# EAGLE design receptor_same (EAGLE 9.3.2)

## Sheet 1 of 2
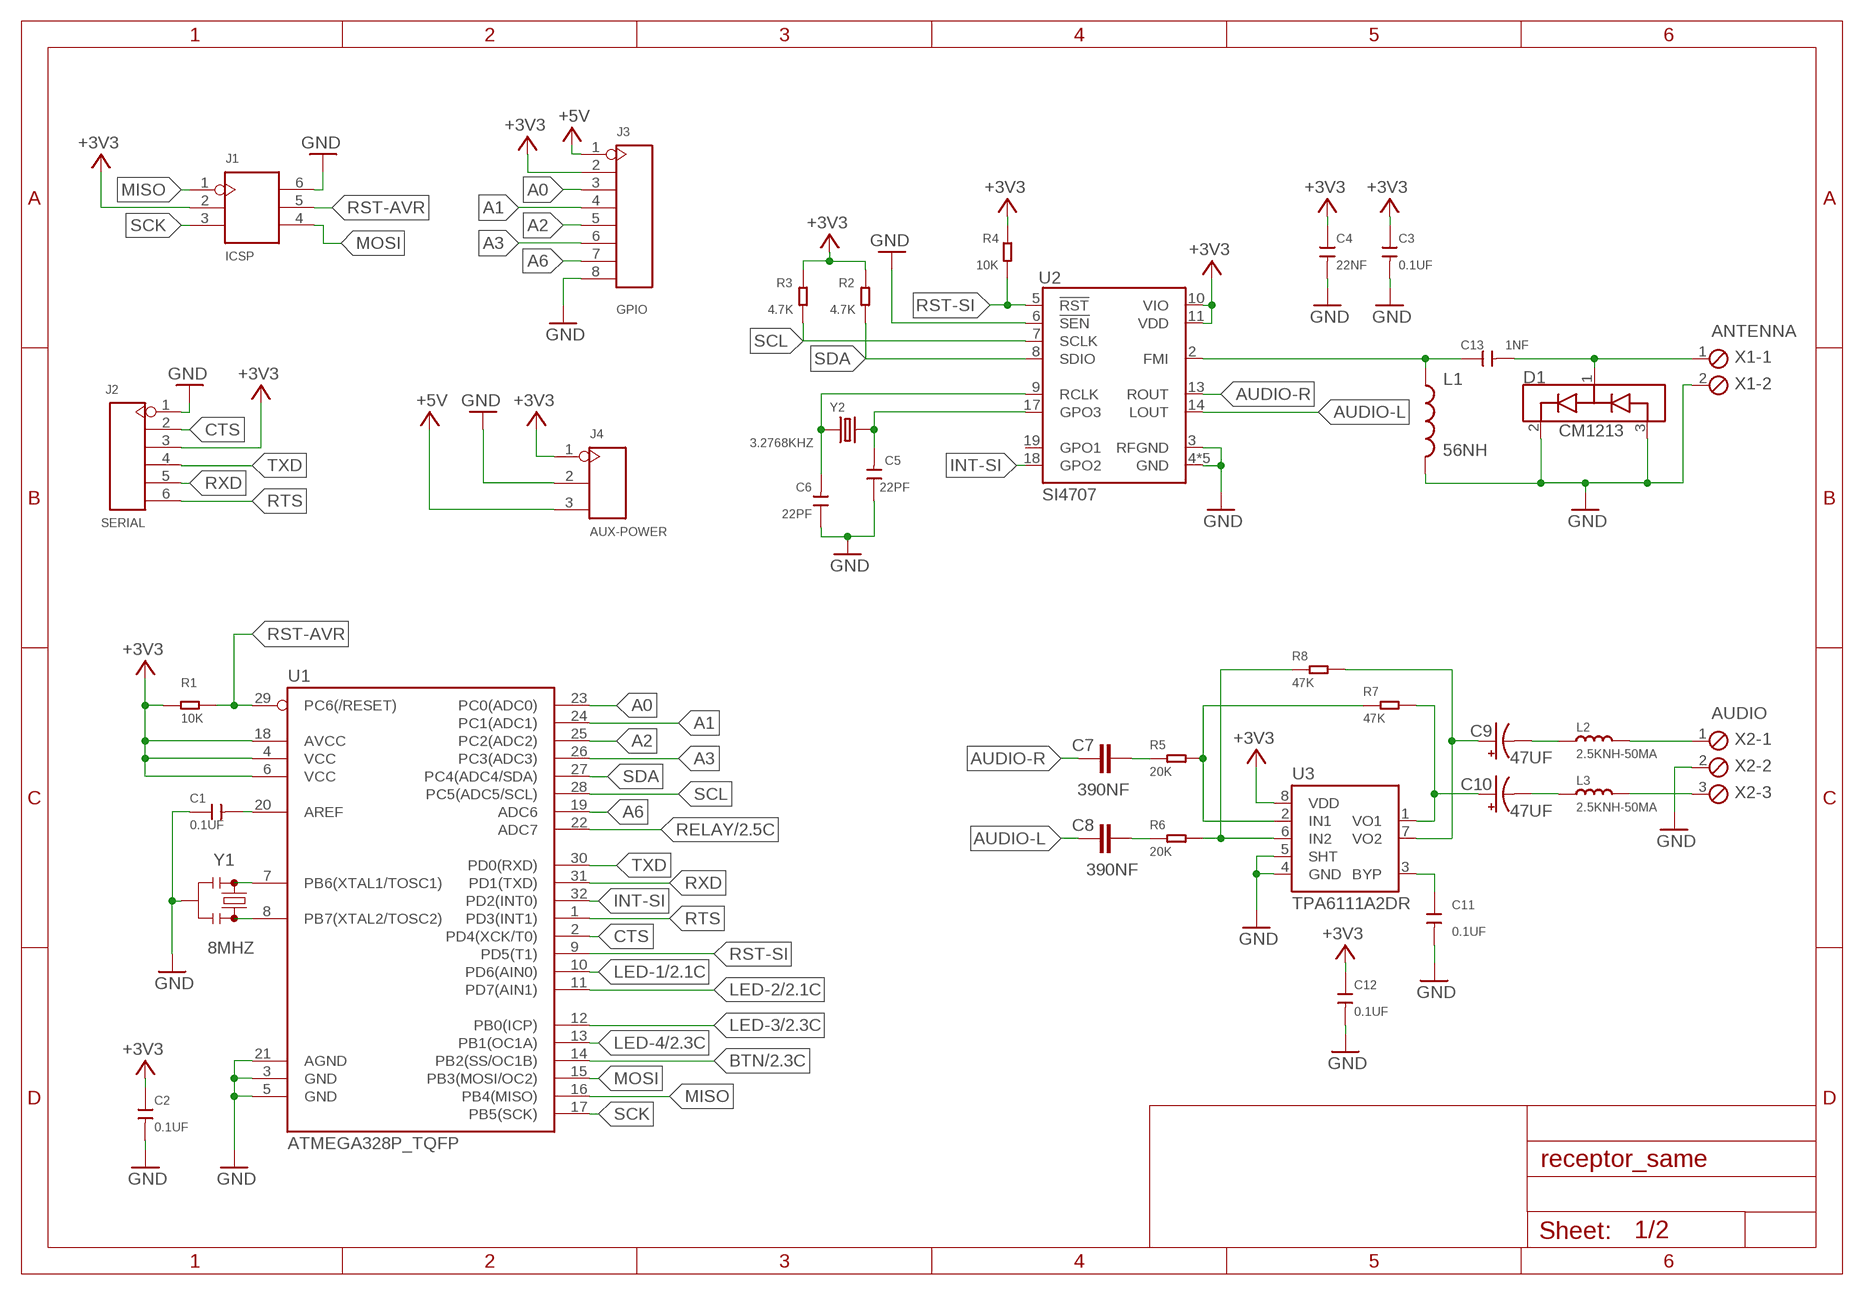
[diagram p0: schematic, sheet 1]

### Parts
C1  0.1UF  CERAMIC-100NF-50V-10%-X7R(0603)  [C0603]
C2  0.1UF  CERAMIC-100NF-50V-10%-X7R(0603)  [C0603]
C3  0.1UF  CERAMIC-100NF-50V-10%-X7R(0603)  [C0603]
C4  22NF  CERAMIC-22NF-50V-10%-X7R(0603)  [C0603]
C5  22PF  CERAMIC-22PF-50V-5%-NPO(0603)  [C0603]
C6  22PF  CERAMIC-22PF-50V-5%-NPO(0603)  [C0603]
C7  390NF  390NF-0603-10V-10%  [0603]
C8  390NF  390NF-0603-10V-10%  [0603]
C9  47UF  47UF-POLAR-EIA3528-10V-10%  [EIA3528]
C10  47UF  47UF-POLAR-EIA3528-10V-10%  [EIA3528]
C11  0.1UF  CERAMIC-100NF-50V-10%-X7R(0603)  [C0603]
C12  0.1UF  CERAMIC-100NF-50V-10%-X7R(0603)  [C0603]
C13  1NF  CERAMIC-1NF-50V-5%-C0G(0603)  [C0603]
D1  CM1213  SPARKFUN-DISCRETESEMI_CM1213  [SPARKFUN-DISCRETESEMI_SOT23-3]
J1  ICSP  DIP-BLACK-MALE-HEADER(2X3P-2.54）-2.54  [H2X3-2.54]
J2  SERIAL  DIP-BLACK-MALE-HEADER(6P-2.54)  [H6-2.54]
J3  GPIO  DIP-BLACK-MALE-HEADER-VERT(8P-2.54)  [H8-2.54]
J4  AUX-POWER  DIP-BLACK-MALE-HEADER-VERT(3P-2.54)  [H3-2.54]
L1  56NH  SPARKFUN-PASSIVES_INDUCTOR0603  [SPARKFUN-PASSIVES_0603]
L2  2.5KNH-50MA  SMD-INDUCTOR-4.7NH-0.3NH-300MA(0402)  [L0402]
L3  2.5KNH-50MA  SMD-INDUCTOR-4.7NH-0.3NH-300MA(0402)  [L0402]
R1  10K  SMD-RES-10K-5%-1/10W(0603)  [R0603]
R2  4.7K  SMD-RES-4.7K-5%-1/10W(0603)  [R0603]
R3  4.7K  SMD-RES-4.7K-5%-1/10W(0603)  [R0603]
R4  10K  SMD-RES-10K-5%-1/10W(0603)  [R0603]
R5  20K  SMD-RES-20K-1%-1/10W(0603)  [R0603]
R6  20K  SMD-RES-20K-1%-1/10W(0603)  [R0603]
R7  47K  SMD-RES-47K-5%-1/10W(0603)  [R0603]
R8  47K  SMD-RES-47K-5%-1/10W(0603)  [R0603]
U1  ATMEGA328P_TQFP  [TQFP32-08]
U2  SI4707  SPARKFUN-RF_SI4707  [SPARKFUN-RF_SI470X]
U3  TPA6111A2DR  TPA6111SMD-T  [SO08]
X1  ANTENNA  MPT2  [2POL254]
X2  AUDIO  MPT3  [3POL254]
Y1  8MHZ  RESONATOR-8MHZSMD_3.2X1.3  [RESONATOR-SMD-3.2X1.3]
Y2  3.2768KHZ  SMD-CRYSTAL-32.768KHZ-12.5PF-20PPM-90K(2P-L2.0X1.2MM)  [X2-SMD-L2.0X1.2X0.55MM]

### Nets
+3V3: C2.1 C3.1 C4.1 C12.1 J1.2 J2.3 J3.2 J4.1 R1.2 R2.1 R3.1 R4.1 U1.4(VCC) U1.6(VCC) U1.18(AVCC) U2.10(VIO) U2.11(VDD) U3.8(VDD) ; also sheet 2
+5V: J3.1 J4.3 ; also sheet 2
A0: J3.3 U1.23(PC0(ADC0))
A1: J3.4 U1.24(PC1(ADC1))
A2: J3.5 U1.25(PC2(ADC2))
A3: J3.6 U1.26(PC3(ADC3))
A6: J3.7 U1.19(ADC6)
AUDIO-L: C8.1 U2.14(LOUT)
AUDIO-R: C7.1 U2.13(ROUT)
BTN: U1.14(PB2(SS/OC1B)) ; also sheet 2
CTS: J2.2 U1.2(PD4(XCK/T0))
GND: C1.1 C2.2 C3.2 C4.2 C5.1 C6.1 C11.2 C12.2 D1.2(VP) D1.3(VN) J1.6 J2.1 J3.8 J4.2 L1.2 U1.3(GND) U1.5(GND) U1.21(AGND) U2.3(RFGND) U2.4(GND) U2.6(!SEN) U2.12(GND) U2.15(GND) U2.16(GND) U2.21(GND) U3.4(GND) U3.5(SHT) X1.2 X2.2 Y1.2 ; also sheet 2
INT-SI: U1.32(PD2(INT0)) U2.18(GPO2)
L: L2.2 X2.1
LED-1: U1.10(PD6(AIN0)) ; also sheet 2
LED-2: U1.11(PD7(AIN1)) ; also sheet 2
LED-3: U1.12(PB0(ICP)) ; also sheet 2
LED-4: U1.13(PB1(OC1A)) ; also sheet 2
MISO: J1.1 U1.16(PB4(MISO))
MOSI: J1.4 U1.15(PB3(MOSI/OC2))
N$1: U1.7(PB6(XTAL1/TOSC1)) Y1.1
N$2: U1.8(PB7(XTAL2/TOSC2)) Y1.3
N$3: C1.2 U1.20(AREF)
N$4: C5.2 U2.17(GPO3) Y2.2
N$5: C6.2 U2.9(RCLK) Y2.1
N$6: C13.1 L1.1 U2.2(FMI)
N$7: C7.2 R5.1
N$8: C8.2 R6.1
N$9: C11.1 U3.3(BYP)
N$10: R5.2 R7.1 U3.2(IN1)
N$11: C10.A(+) R7.2 U3.1(VO1)
N$12: R6.2 R8.1 U3.6(IN2)
N$13: C9.A(+) R8.2 U3.7(VO2)
N$14: C9.C(-) L2.1
N$17: C10.C(-) L3.1
N$22: C13.2 D1.1(CH1) X1.1
R: L3.2 X2.3
RELAY: U1.22(ADC7) ; also sheet 2
RST-AVR: J1.5 R1.1 U1.29(PC6(/RESET))
RST-SI: R4.2 U1.9(PD5(T1)) U2.5(!RST)
RTS: J2.6 U1.1(PD3(INT1))
RXD: J2.5 U1.31(PD1(TXD))
SCK: J1.3 U1.17(PB5(SCK))
SCL: R3.2 U1.28(PC5(ADC5/SCL)) U2.7(SCLK)
SDA: R2.2 U1.27(PC4(ADC4/SDA)) U2.8(SDIO)
TXD: J2.4 U1.30(PD0(RXD))
Unconnected: U2.19(GPO1)

## Sheet 2 of 2
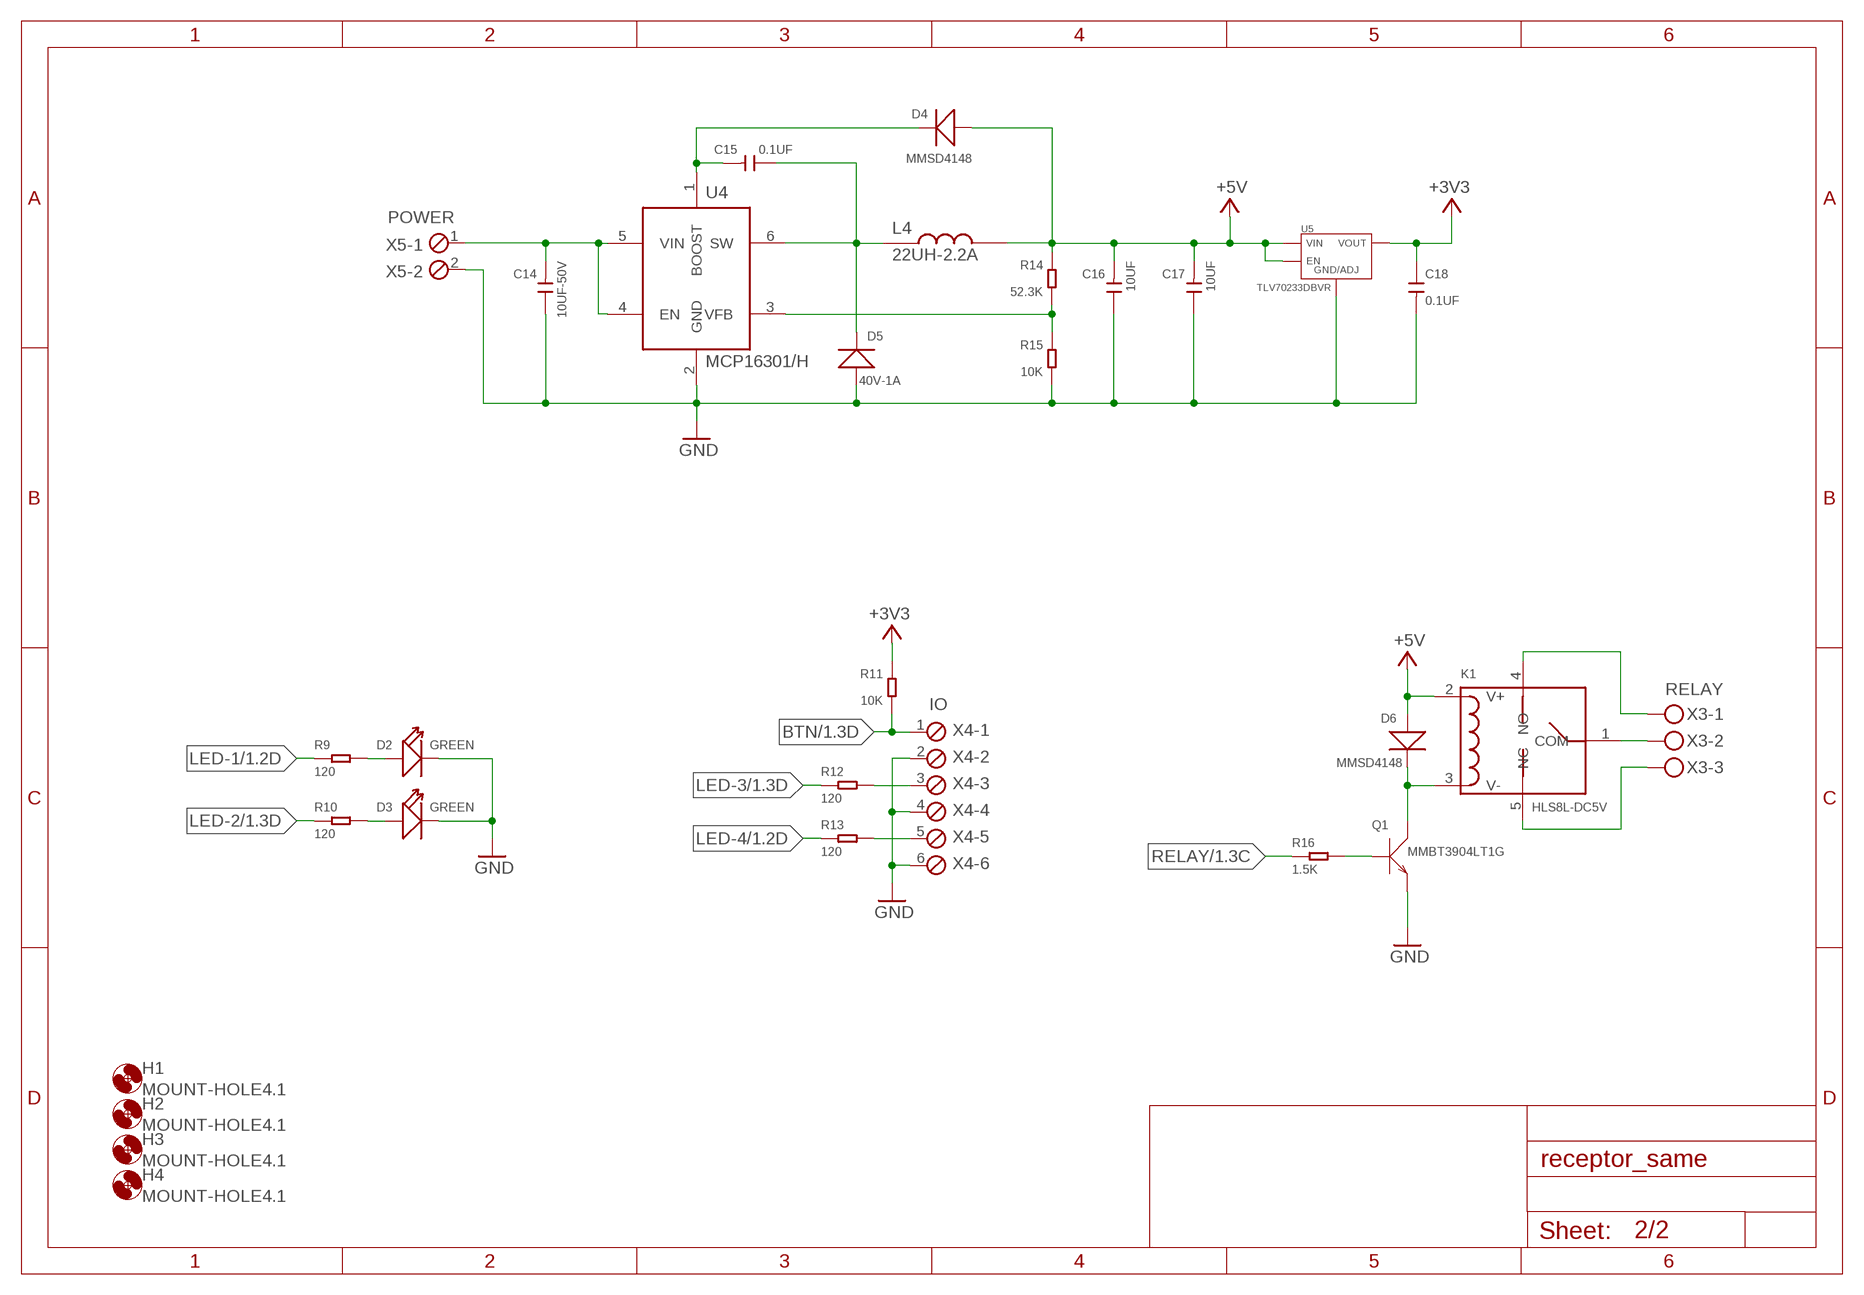
[diagram p1: schematic, sheet 2]

### Parts
C14  10UF-50V  CERAMIC-10UF-25V-10%-X5R(1206)  [C1206]
C15  0.1UF  CERAMIC-100NF-50V-10%-X7R(0603)  [C0603]
C16  10UF  CERAMIC-10UF-6.3V-20%-X5R(0603)  [C0603]
C17  10UF  CERAMIC-10UF-6.3V-20%-X5R(0603)  [C0603]
C18  0.1UF  CERAMIC-100NF-50V-10%-X7R(0603)  [C0603]
D2  GREEN  SMD-LED-CLEAR-GREEN(0805)  [LED-0805]
D3  GREEN  SMD-LED-CLEAR-GREEN(0805)  [LED-0805]
D4  MMSD4148  SMD-DIODE-100V-200MA(SOD-123)  [SOD-123]
D5  40V-1A  SMD-DIODE-SCHOTTKY-40V-1A(DO-214AC)  [DO-214AC]
D6  MMSD4148  SMD-DIODE-100V-200MA(SOD-123)  [SOD-123]
H1  MOUNT-HOLE4.1  [4,1]
H2  MOUNT-HOLE4.1  [4,1]
H3  MOUNT-HOLE4.1  [4,1]
H4  MOUNT-HOLE4.1  [4,1]
K1  HLS8L-DC5V  RELAY-HLS8L-DC5V-S-CHLS8L-DC5V-S-C  [REY5-19.0X15.0X15.0MM]
L4  22UH-2.2A  303010525_22UH_7.1X6.6MM  [L2826]
Q1  MMBT3904LT1G  SMD-TRANSISTORS-NPN-40V-200MA-MMBT3904LT1G(SOT-23)  [SOT-23]
R9  120  SMD-RES-120R-5%-1/8W(0805)  [R0805]
R10  120  SMD-RES-120R-5%-1/8W(0805)  [R0805]
R11  10K  SMD-RES-10K-5%-1/10W(0603)  [R0603]
R12  120  SMD-RES-120R-5%-1/8W(0805)  [R0805]
R13  120  SMD-RES-120R-5%-1/8W(0805)  [R0805]
R14  52.3K  SMD-RES-51K-5%-1/10W(0603)  [R0603]
R15  10K  SMD-RES-10K-5%-1/10W(0603)  [R0603]
R16  1.5K  SMD-RES-1.5K-5%-1/10W(0603)  [R0603]
U4  MCP16301/H  [SOT23-6]
U5  TLV70233DBVR  TLV70233PDBVR  [SOT-23-5]
X3  RELAY  MKDSN1,5/3-5,08  [MKDSN1,5/3-5,08]
X4  IO  MPT6  [6POL254]
X5  POWER  MPT2  [2POL254]

### Nets
+3V3: C18.1 R11.1 U5.P$5(VOUT) ; also sheet 1
+5V: C16.2 C17.2 D4.+ D6.+ K1.2(V+) L4.P$2 R14.2 U5.P$1(VIN) U5.P$3(EN) ; also sheet 1
BTN: R11.2 X4.1 ; also sheet 1
GND: C14.1 C16.1 C17.1 C18.2 D2.- D3.- D5.1(+) Q1.2(E) R15.2 U4.2(GND) U5.P$2(GND/ADJ) X4.2 X4.4 X4.6 X5.2 ; also sheet 1
LED-1: R9.1 ; also sheet 1
LED-2: R10.1 ; also sheet 1
LED-3: R12.1 ; also sheet 1
LED-4: R13.1 ; also sheet 1
N$18: R12.2 X4.3
N$19: D3.+ R10.2
N$20: D2.+ R9.2
N$21: R13.2 X4.5
N$24: C15.2 D4.- U4.1(BOOST)
N$26: K1.1(COM) X3.2
N$27: R14.1 R15.1 U4.3(VFB)
N$28: K1.4(NO) X3.1
N$29: K1.5(NC) X3.3
N$30: D6.- K1.3(V-) Q1.3(C)
N$31: Q1.1(B) R16.2
RELAY: R16.1 ; also sheet 1
SW: C15.1 D5.2(-) L4.P$1 U4.6(SW)
VIN: C14.2 U4.4(EN) U4.5(VIN) X5.1

## Library data of the parts
C1-C3 C11 C12 C15 C18 = OPL_Capacitor:CERAMIC-100NF-50V-10%-X7R(0603): 302010138; MPN: CC0603KRX7R9BB104; VALUE: 100nf
C4 = OPL_Capacitor:CERAMIC-22NF-50V-10%-X7R(0603): 302010095; MPN: CC0603KRX7R9BB223; VALUE: 22nf
C5 C6 = OPL_Capacitor:CERAMIC-22PF-50V-5%-NPO(0603): 302010143; MPN: CC0603JRNPO9BN220; SPICEPREFIX: C; VALUE: 22pf
C7 C8 = SparkFun-Capacitors:390NF: 0.39uF/390nF ceramic capacitors A capacitor is a passive two-terminal electrical component used to store electrical energy temporarily in an electric field.; MPN: CC0603KRX7R6BB394; PROD_ID: CAP-10986; SPICEPREFIX: C; VALUE: 390nF
C9 C10 = SparkFun-Capacitors:47UF-POLAR: 47µF polarized capacitors A capacitor is a passive two-terminal electrical component used to store electrical energy temporarily in an electric field.; MPN: TAJB476K010RNJ; PROD_ID: CAP-08310; SPICEPREFIX: C; VALUE: 47uF
C13 = OPL_Capacitor:CERAMIC-1NF-50V-5%-C0G(0603): 302010341; MPN: GRM1885C1H102JA01D; VALUE: 1nf
C14 = OPL_Capacitor:CERAMIC-10UF-25V-10%-X5R(1206): 302010181; MPN: CL31A106KBHNNNE; VALUE: 10uf
C16 C17 = OPL_Capacitor:CERAMIC-10UF-6.3V-20%-X5R(0603): 302010286; MPN: CC0603MRX5R5BB106; VALUE: 10UF 6.3V
D1 = sparkfun_si4707_breakout:SPARKFUN-DISCRETESEMI_CM1213; MPN: CM1213A-01SO; URL: https://www.digikey.com.mx/product-detail/en/on-semiconductor/CM1213A-01SO/CM1213A-01SOOSCT-ND/3462265
D2 D3 = OPL_Optoelectronics:SMD-LED-CLEAR-GREEN(0805): 304090057; MPN: 17-215SYGC/S530-E2/TR8; VALUE: GREEN-0805
D4 D6 = OPL_Discrete_Semiconductor:SMD-DIODE-100V-200MA(SOD-123): 304010007; MPN: MMSD4148; VALUE: MMSD4148-sod123
D5 = OPL_Discrete_Semiconductor:SMD-DIODE-SCHOTTKY-40V-1A(DO-214AC): 304020027; MPN: 1N5819
H1-H4 = holes:MOUNT-HOLE: MOUNTING HOLE with drill center marker
J1 = OPL_Connector:DIP-BLACK-MALE-HEADER(2X3P-2.54）: 320020077; MPN: P125-12A1BS116A1; VALUE: 2x3p-2.54
J2 = OPL_Connector:DIP-BLACK-MALE-HEADER(6P-2.54): 320020078; MPN: P125-1106A1BS116A1; SPICEPREFIX: X; VALUE: 6p-2.54
J3 = OPL_Connector:DIP-BLACK-MALE-HEADER-VERT(8P-2.54): 320020080; MPN: P125-1108A1BS116A1; VALUE: 8p-2.54
J4 = OPL_Connector:DIP-BLACK-MALE-HEADER-VERT(3P-2.54): 320020079; MPN: P125-1103A1BS116A1; VALUE: 3p-2.54
K1 = OPL_Relay:RELAY-HLS8L-DC5V-S-C: 315030000; MPN: HLS8L-DC5V-S-C
L1 = sparkfun_si4707_breakout:SPARKFUN-PASSIVES_INDUCTOR: Inductors Basic Inductor/Choke - 0603 and 1206. Footprints are not proven and vary greatly between part numbers.; MPN: SDCL1608C56NJTDF
L2 L3 = OPL_Inductor:SMD-INDUCTOR-4.7NH-0.3NH-300MA(0402): 303010037; MPN: BLM18BD252SN1D; SPICEPREFIX: L; VALUE: 4.7NH-300MA
L4 = seed-opl-2017-01-inductor-akita:303010525_22UH_7.1X6.6MM: SHC0603-220M, SMD Inductor 22uH-20%-0.139R-2.2A;2P-L7.1*W6.6*H3.0mm, SKU: 303010525; MPN: SHC0603-220M
Q1 = OPL_Discrete_Semiconductor:SMD-TRANSISTORS-NPN-40V-200MA-MMBT3904LT1G(SOT-23): 305010013; MPN: MMBT3904LT1G
R1 R4 R11 R15 = OPL_Resistor:SMD-RES-10K-5%-1/10W(0603): 301010293; MPN: RC0603JR-0710KL; VALUE: 10K 1/10W
R2 R3 = OPL_Resistor:SMD-RES-4.7K-5%-1/10W(0603): 301010290; MPN: RC0603JR-074K7L
R5 R6 = OPL_Resistor:SMD-RES-20K-1%-1/10W(0603): 301011971; MPN: RC0603FR-0720KL; SPICEPREFIX: R
R7 R8 = OPL_Resistor:SMD-RES-47K-5%-1/10W(0603): 301010084; MPN: RC0603JR-0747KL; SPICEPREFIX: R
R9 R10 R12 R13 = OPL_Resistor:SMD-RES-120R-5%-1/8W(0805): 301012183; MPN: RC0805JR-07120RL; VALUE: 1K
R14 = OPL_Resistor:SMD-RES-51K-5%-1/10W(0603): 301012135; MPN: WR06X5232FTL; VALUE: 51K
R16 = OPL_Resistor:SMD-RES-1.5K-5%-1/10W(0603): 301010114; MPN: RC0603JR-071K5L; VALUE: 1.5K 1/10W
U1 = SparkFun-IC-Microcontroller:ATMEGA328P_TQFP: Popular 328P in QFP Storefront component: ATmega328 - TQFP <https://www.sparkfun.com/products/13448> (COM-13448) Datasheet <http://www.sparkfun.com/datasheets/Components/SMD/ATMega328.pdf> SparkFun Products SparkFun RedBoard - Programmed with Arduino <https://www.sparkfun.com/products/12757> (DEV-12757) Arduino Pro Mini 328 - 5V/16MHz <https://www.sparkfun.com/products/11113> (DEV-11113) Arduino Pro Mini 328 - 3.3V/8MHz <https://www.sparkfun.com/products/11114> (DEV-11114) SparkFun OpenLog <https://www.sparkfun.com/products/13712> (DEV-13712) SparkFun MicroView - OLED Arduino Module <https://www.sparkfun.com/products/12923> (DEV-12923) SparkFun Digital Sandbox <https://www.sparkfun.com/products/12651> (DEV-12651) SparkFun PicoBoard <https://www.sparkfun.com/products/11888> (WIG-11888) Arduino Fio <https://www.sparkfun.com/products/10116> (DEV-10116) LilyPad Arduino 328 Main Board <https://www.sparkfun.com/products/13342> (DEV-13342) SparkFun RedStick <https://www.sparkfun.com/products/13741> (DEV-13741) LilyPad MP3 <https://www.sparkfun.com/products/11013> (DEV-11013) LilyPad Arduino SimpleSnap <https://www.sparkfun.com/products/10941> (DEV-10941) SparkFun Stepoko <https://www.sparkfun.com/products/13899> (ROB-13899) SparkFun Geiger Counter <https://www.sparkfun.com/products/11345> (SEN-11345) SparkFun EL Sequencer <https://www.sparkfun.com/products/12781> (COM-12781) Arduino Pro 328 - 5V/16MHz <https://www.sparkfun.com/products/10915> (DEV-10915) CryptoCape <https://www.sparkfun.com/products/12773> (DEV-12773) SparkFun IR Thermometer Evaluation Board - MLX90614 <https://www.sparkfun.com/products/10740> (SEN-10740) SparkFun RedBot Mainboard <https://www.sparkfun.com/products/12097> (ROB-12097) Arduino Pro 328 - 3.3V/8MHz <https://www.sparkfun.com/products/10914> (DEV-10914) SparkFun Block for Intel® Edison - Arduino <https://www.sparkfun.com/products/13036> (DEV-13036) SparkFun Simon Says - Surface Mount Soldering Kit <https://www.sparkfun.com/products/10935> (KIT-10935) SparkFun 7-Segment Serial Display - Red <https://www.sparkfun.com/products/11441> (COM-11441) SparkFun 7-Segment Serial Display - White <https://www.sparkfun.com/products/11629> (COM-11629) SparkFun 7-Segment Serial Display - Yellow <https://www.sparkfun.com/products/11443> (COM-11443) SparkFun 7-Segment Serial Display - Kelly Green <https://www.sparkfun.com/products/11440> (COM-11440) SparkFun 7-Segment Serial Display - Blue <https://www.sparkfun.com/products/11442> (COM-11442) SparkFun OpenSegment Serial Display - 20mm (Blue) <https://www.sparkfun.com/products/11647> (COM-11647) SparkFun OpenSegment Serial Display - 20mm (Green) <https://www.sparkfun.com/products/11646> (COM-11646) SparkFun OpenSegment Serial Display - 20mm (White) <https://www.sparkfun.com/products/11648> (COM-11648) SparkFun OpenSegment Serial Display - 20mm (Red) <https://www.sparkfun.com/products/11644> (COM-11644) SparkFun OpenSegment Serial Display - 20mm (Yellow) <https://www.sparkfun.com/products/11645> (COM-11645) SparkFun OpenSegment Shield <https://www.sparkfun.com/products/13190> (DEV-13190); MPN: ATMEGA328P-AU; PROD_ID: IC-09069
U2 = si4707:SPARKFUN-RF_SI4707: Silicon Labs Si4707 Weather Band and SAME Data Receiver Weather Band support - 162.4-162.55MHz SAME Processor 1050 Hz alert tone WB digital tuning Package: QFN-20 (SI470X.PAC), 3x3x0.55mm, 20 pin Supply Voltage: 2.7 to 5.5V VDD 1.5 to 3.6V VIO Supply current: 19.1 to 23mA; MPN: SI4707-B20-GM; SPICEPREFIX: X; URL: https://www.digikey.com/product-detail/en/silicon-labs/SI4707-B20-GM/336-2147-ND/2686997
U3 = SparkFun-IC-Amplifiers:TPA6111: TPA6111A2 Basic 150mW stereo headphone amplifier. SparkFun Products SparkFun FM Tuner Evaluation Board - Si4703 <https://www.sparkfun.com/products/12938> (WRL-12938); MPN: TPA6111A2DR; PROD_ID: IC-10149; SPICEPREFIX: X; URL: https://www.digikey.com/product-detail/en/texas-instruments/TPA6111A2DR/296-10846-1-ND/381452
U4 = mcp16301:MCP16301/H: High-Voltage Input Integrated Switch Step-Down Regulator; MPN: MCP16301T-I/CHY
U5 = mf_ic_power:TLV702: Manufacturer Part #: TLV702 Manufacturer: Texas Instruments Description: LDO Voltage Regulators; HOUSEPART: YES; MPN: TLV70233DBVR; POPULATE: 1; VALUE: MF-REG-SOT235-3.3V-300mA
X1 X5 = con-phoenix-254:MPT2: PHOENIX CONNECTOR; MPN: 1725656; OC_FARNELL: unknown; OC_NEWARK: unknown
X2 = con-phoenix-254:MPT3: PHOENIX CONNECTOR; MPN: 1725669; OC_FARNELL: unknown; OC_NEWARK: unknown; SPICEPREFIX: X
X3 = con-phoenix-508:MKDSN1,5/3-5,08: MKDSN 1,5/ 3-5,08 Printklemme Nennstrom: 13,5 A Nennspannung: 250 V Rastermaß: 5,08 mm Polzahl: 3 Anschlussart: Schraubanschluss Montage: Löten Anschlussrichtung Leiter/Platine: 0 ° Artikelnummer: 1729131 Source: http://eshop.phoenixcontact.com .. 1729131.pdf; MPN: 1715734
X4 = con-phoenix-254:MPT6: PHOENIX CONNECTOR; MPN: 1725698; OC_FARNELL: unknown; OC_NEWARK: unknown
Y1 = SparkFun-Clocks:RESONATOR-8MHZ: 8MHz Resonator Digikey Example <http://www.digikey.com/product-detail/en/murata-electronics-north-america/CSTCE10M0G55-R0/490-1196-1-ND/584633> Frequency: 8MHz Frequency Stability: ±0.2% Frequency Tolerance: ±0.5% Capacitance: 33pF SparkFun Products Arduino Pro Mini 328- 3.3V/8MHz <https://www.sparkfun.com/products/11114> SparkFun Digital Sandbox <https://www.sparkfun.com/products/12651>; MPN: CSTCE8M00G55-R0; PROD_ID: XTAL-08895; VALUE: 8MHz
Y2 = OPL_Crystal Oscillator:SMD-CRYSTAL-32.768KHZ-12.5PF-20PPM-90K(2P-L2.0X1.2MM): 306010020; MPN: FC-12M; SPICEPREFIX: B

## Board
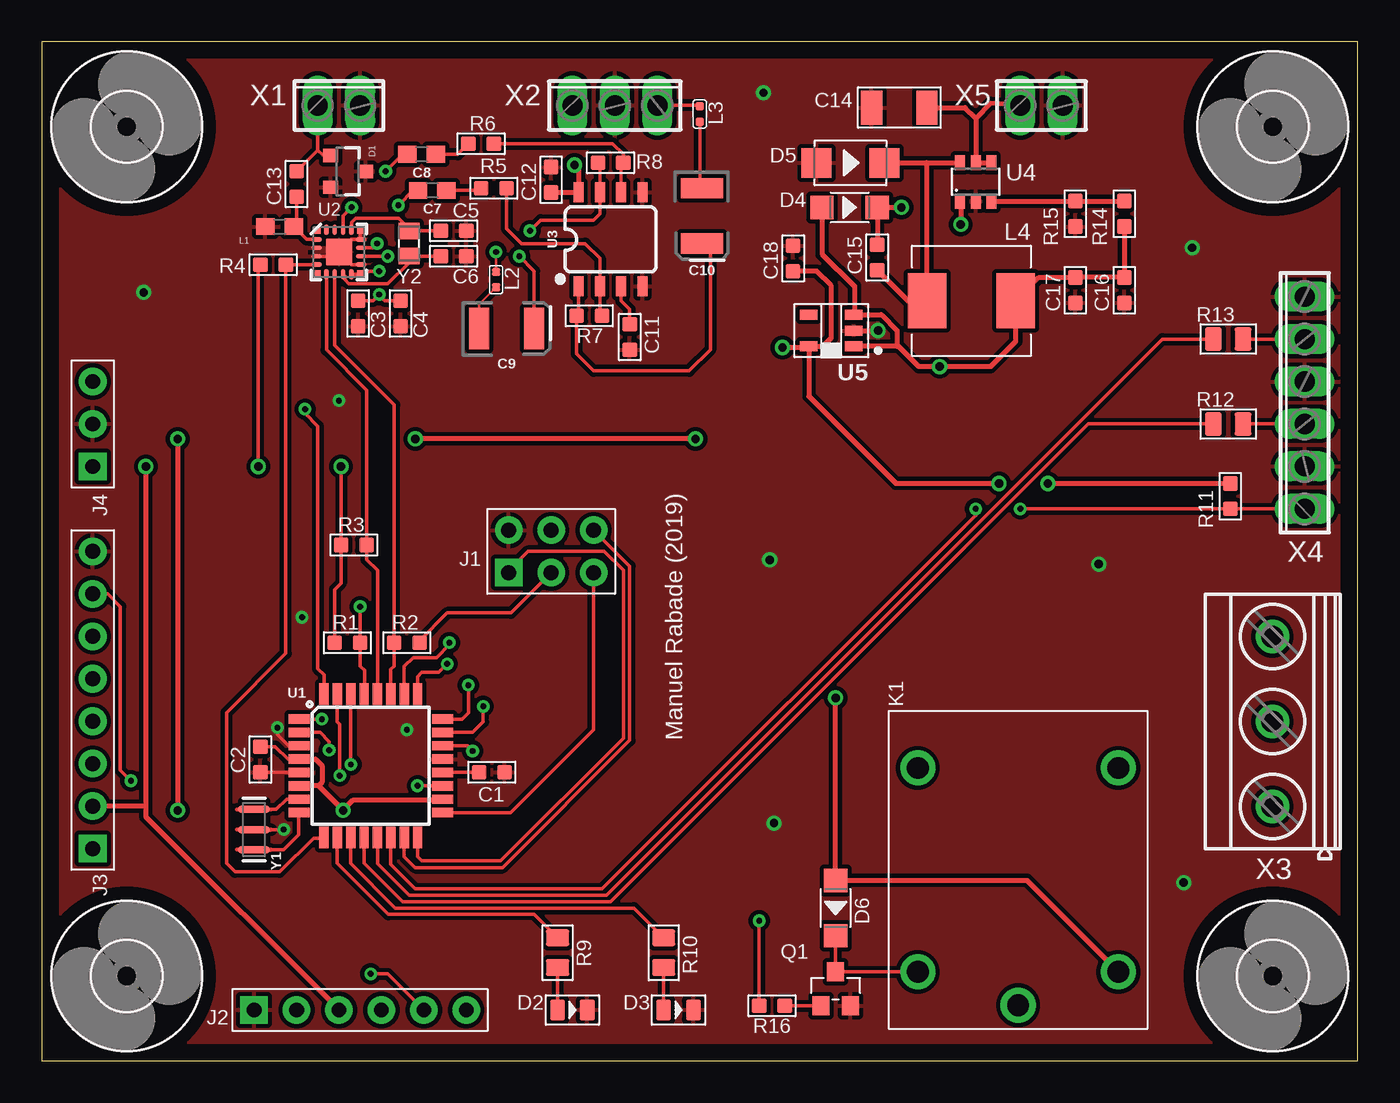
[diagram p2: board, top side]
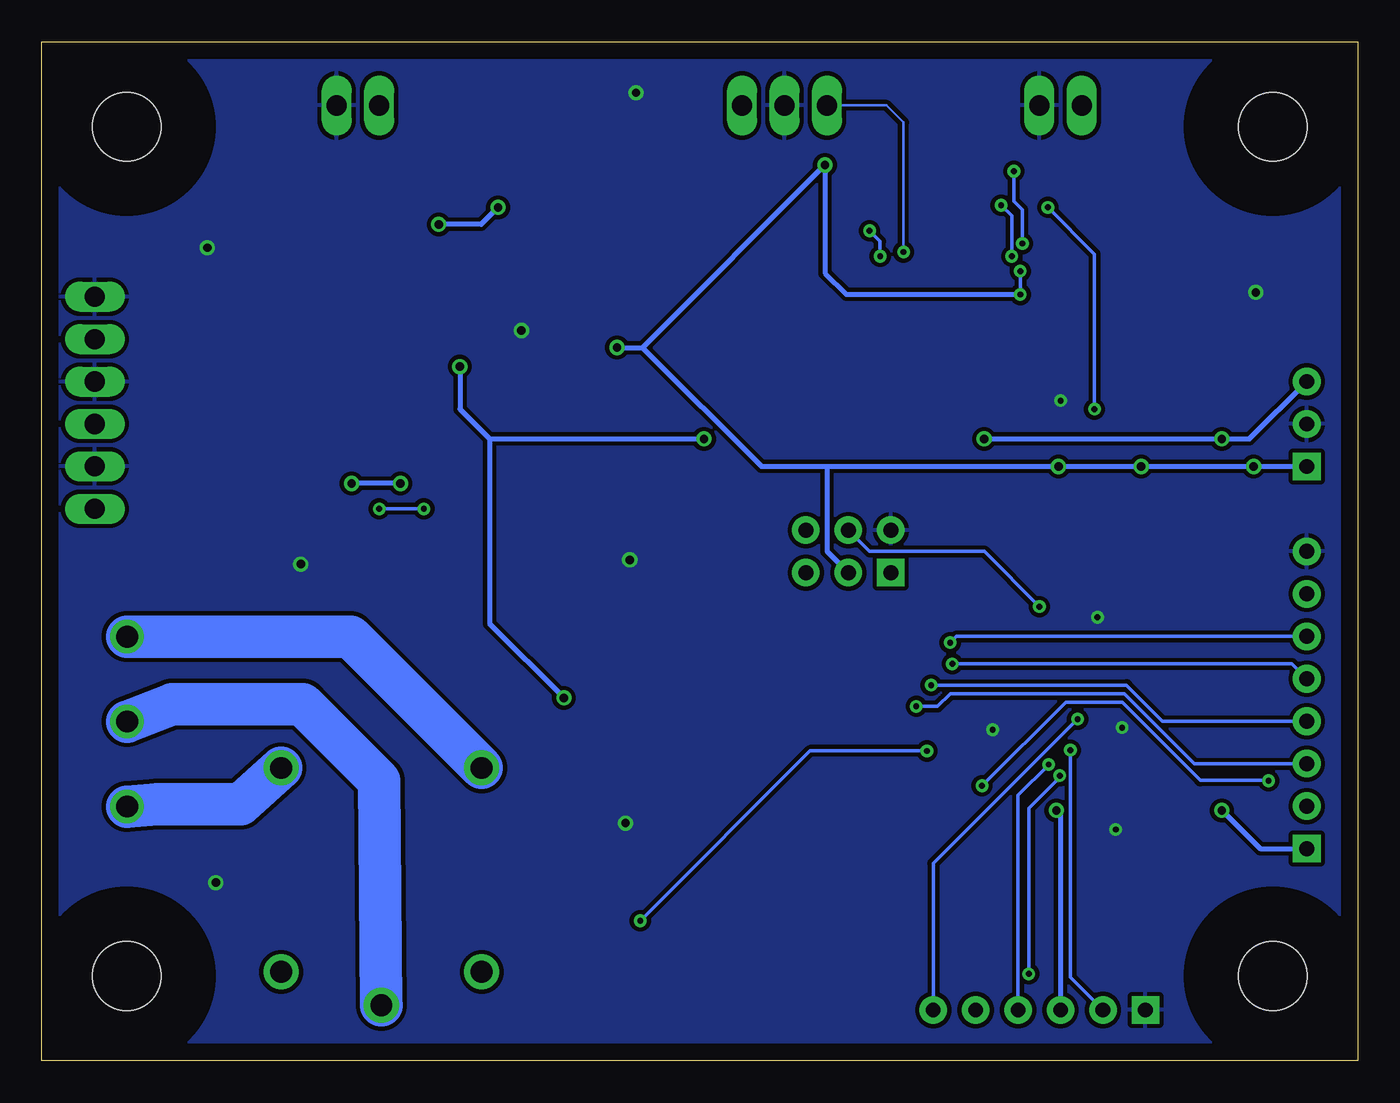
[diagram p3: board, bottom side, seen from below]

Size 78.74 x 60.96 mm. Coordinates in mm from the lower left corner, seen from the top.
Outline: 0,0 78.74,0 78.74,60.96 0,60.96 0,0
Copper layers (1*16): Top 0.035mm / dielectric 1.5mm / Bottom 0.035mm
Design rules "default": minimum track width 6mil, minimum drill 0.35mm, track to track 6mil, track to pad 6mil, pad to pad 6mil, via to via 6mil, smd to smd 6mil, copper to edge 40mil, drill to drill 6mil, minimum pad ring 10mil, minimum via ring 8mil, stop-mask expansion 4mil, vias tented up to drill 0mil, thermal gap 10mil

### Footprints (pad centres in the part's own frame; a part is rotated, then mirrored left to right if it is on the bottom)
C0603 = smd 0.889 x 0.889: 1 0,0.762; 2 0,-0.762
0603 = smd 1.1 x 1: 1 -0.85,0; 2 0.85,0
EIA3528 = smd 1.2 x 2.5: A 1.65,0; C -1.65,0
C1206 = smd 1.27 x 2.032: 1 -1.651,0; 2 1.651,0
SPARKFUN-DISCRETESEMI_SOT23-3 = smd 0.8 x 0.9: 1 -0.95,-1; 2 0.95,-1; 3 0,1.1
LED-0805 = smd 0.889 x 1.27: + -0.889,0; - 0.889,0
SOD-123 = smd 1.397 x 1.397: + -1.651,0; - 1.651,0
DO-214AC = smd 1.8 x 1.77: 1 -2.042,0; 2 2.042,0
4,1 = hole 4.1: 0,0
H2X3-2.54 = drill 0.889 pad 1.651 square: 1 -1.27,2.54 | drill 0.889 pad 1.651: 2 -1.27,0; 3 -1.27,-2.54; 4 1.27,-2.54; 5 1.27,0; 6 1.27,2.54
H6-2.54 = drill 0.889 pad 1.651 square: 1 0,6.35 | drill 0.889 pad 1.651: 2 0,3.81; 3 0,1.27; 4 0,-1.27; 5 0,-3.81; 6 0,-6.35
H8-2.54 = drill 0.889 pad 1.651 square: 1 0,8.89 | drill 0.889 pad 1.651: 2 0,6.35; 3 0,3.81; 4 0,1.27; 5 0,-1.27; 6 0,-3.81; 7 0,-6.35; 8 0,-8.89
H3-2.54 = drill 0.889 pad 1.651 square: 1 0,2.54 | drill 0.889 pad 1.651: 2 0,0; 3 0,-2.54
REY5-19.0X15.0X15.0MM = drill 1.3 pad 2.1: 1 -8.1,0; 2 -6.1,-6; 3 -6.1,6; 4 6.1,-6; 5 6.1,6
SPARKFUN-PASSIVES_0603 = smd 1.1 x 1: 1 -0.85,0; 2 0.85,0
L0402 = smd 0.5 x 0.5: 1 -0.463,0; 2 0.463,0
L2826 = smd 2.3 x 3.3: P$1 -2.65,0; P$2 2.65,0
SOT-23 = smd 1.016 x 1.143: 1 -0.889,-1.016; 2 0.889,-1.016; 3 0,1.016
R0603 = smd 0.889 x 0.889: 1 0,0.762; 2 0,-0.762
R0805 = smd 1.397 x 1.016: 1 0,0.889; 2 0,-0.889
TQFP32-08 = smd 1.27 x 0.559: 1 -4.293,2.8; 2 -4.293,2; 3 -4.293,1.2; 4 -4.293,0.4; 5 -4.293,-0.4; 6 -4.293,-1.2; 7 -4.293,-2; 8 -4.293,-2.8; 17 4.293,-2.8; 18 4.293,-2; 19 4.293,-1.2; 20 4.293,-0.4; 21 4.293,0.4; 22 4.293,1.2; 23 4.293,2; 24 4.293,2.8 | smd 0.559 x 1.27: 9 -2.8,-4.293; 10 -2,-4.293; 11 -1.2,-4.293; 12 -0.4,-4.293; 13 0.4,-4.293; 14 1.2,-4.293; 15 2,-4.293; 16 2.8,-4.293; 25 2.8,4.293; 26 2,4.293; 27 1.2,4.293; 28 0.4,4.293; 29 -0.4,4.293; 30 -1.2,4.293; 31 -2,4.293; 32 -2.8,4.293
SPARKFUN-RF_SI470X = smd 0.34 x 0.34: 1 -1.275,1.265; 6 -1.265,-1.265; 11 1.265,-1.265; 16 1.265,1.265 | smd 0.61 x 0.28: 2 -1.335,0.75; 3 -1.335,0.25; 4 -1.335,-0.25; 5 -1.335,-0.75; 12 1.335,-0.75; 13 1.335,-0.25; 14 1.335,0.25; 15 1.335,0.75 | smd 0.28 x 0.61: 7 -0.75,-1.335; 8 -0.25,-1.335; 9 0.25,-1.335; 10 0.75,-1.335; 17 0.75,1.335; 18 0.25,1.335; 19 -0.25,1.335; 20 -0.75,1.335 | smd 1.6 x 1.6: 21 0,0
SO08 = smd 0.6 x 1.2: 1 -1.905,-2.8; 2 -0.635,-2.8; 3 0.635,-2.8; 4 1.905,-2.8; 5 1.905,2.8; 6 0.635,2.8; 7 -0.635,2.8; 8 -1.905,2.8
SOT23-6 = smd 0.6 x 0.9: 1 -0.95,-1.15; 2 0,-1.15; 3 0.95,-1.15; 4 0.95,1.15; 5 0,1.15; 6 -0.95,1.15
SOT-23-5 = smd 1.05 x 0.6: P$1 -1.35,0.95; P$2 -1.35,0; P$3 -1.35,-0.95; P$4 1.35,-0.95; P$5 1.35,0.95
2POL254 = drill 1.2 long: 1 -1.27,0; 2 1.27,0
3POL254 = drill 1.2 long: 1 -2.54,0; 2 0,0; 3 2.54,0
MKDSN1,5/3-5,08 = drill 1.3 pad 2: 1 -7.641,0.025; 2 -2.561,0.025; 3 2.519,0.025
6POL254 = drill 1.2 pad 1.778 long: 1 -6.35,0; 2 -3.81,0; 3 -1.27,0; 4 1.27,0; 5 3.81,0; 6 6.35,0
RESONATOR-SMD-3.2X1.3 = smd 0.45 x 1.905: 1 -1.2,0; 2 0,0; 3 1.2,0
X2-SMD-L2.0X1.2X0.55MM = smd 1 x 1.25: 1 -0.75,0; 2 0.75,0

### Placement (x,y rotation side)
C1  26.92,17.27 270 top
C2  13.08,18.03 0 top
C3  18.92,44.7 0 top
C4  21.46,44.7 0 top
C5  24.64,49.66 270 top
C6  24.64,48.13 270 top
C7  23.37,52.07 0 top
C8  22.73,54.23 0 top
C9  27.81,43.81 0 top
C10  39.5,50.55 270 top
C11  35.18,43.31 0 top
C12  30.48,52.7 180 top
C13  15.24,52.45 180 top
C14  51.31,57.02 0 top
C15  49.99,48.06 180 top
C16  64.77,46.1 180 top
C17  61.85,46.1 180 top
C18  44.96,48.01 180 top
D1  18.29,53.21 270 top
D2  31.75,3.05 0 top
D3  38.1,3.05 0 top
D4  48.34,51.05 0 top
D5  48.39,53.72 0 top
D6  47.5,9.14 270 top
H1  5.08,55.88 0 top
H2  5.08,5.08 0 top
H3  73.66,5.08 0 top
H4  73.66,55.88 0 top
J1  30.48,30.48 90 top
J2  19.05,3.05 90 top
J3  3.05,21.59 180 top
J4  3.05,38.1 180 top
K1  58.42,11.43 90 top
L1  14.22,49.91 180 top
L2  27.18,46.74 90 top
L3  39.37,56.64 90 top
L4  55.63,45.47 0 top
Q1  47.5,4.32 0 top
R1  18.29,25.02 270 top
R2  21.84,25.02 270 top
R3  18.67,30.86 90 top
R4  13.84,47.62 90 top
R5  27.05,52.2 90 top
R6  26.29,54.86 90 top
R7  32.77,44.58 270 top
R8  34.04,53.72 270 top
R9  30.86,6.48 0 top
R10  37.21,6.48 0 top
R11  71.12,33.78 0 top
R12  70.99,38.1 90 top
R13  70.99,43.18 90 top
R14  64.77,50.67 0 top
R15  61.85,50.67 0 top
R16  43.69,3.3 90 top
U1  19.68,17.65 0 top
U2  17.78,48.39 0 top
U3  34.04,49.15 0 top
U4  55.88,52.58 0 top
U5  47.24,43.69 180 top
X1  17.78,57.15 0 top
X2  34.29,57.15 0 top
X3  73.66,22.86 90 top
X4  75.56,39.37 90 top
X5  59.82,57.15 0 top
Y1  12.7,13.84 270 top
Y2  21.97,48.9 90 top

### Tracks (layer width: path | path; a pad name or v marks a point on that pad's centre or on a via)
+3V3  (via drill 0.35, 0.5)
  Top 0.152: 15.37,18.03 U1.4
  Top 0.203: v20.19,47.24 19.57,47.24 19.45,47.12 U2.11 18.98,47.05 U2.10 | C3.1 19.81,45.47 v20.19,45.85 20.19,45.83 20.53,45.47 C4.1 | U3.8 | C2.1 13.97,18.8 14.73,18.03 15.37,18.03 | U1.6 15.41,16.47 | R1.2 17.53,28.19 17.91,28.57 R3.1 v17.91,35.56 | 23.95,15.62 U1.18 | J1.2 28.07,26.8 24.26,26.8 22.61,25.15 R2.1 | v12.95,35.56 12.95,47.5 R4.1
  Top 0.305: U3.8 C12.1 | U1.4 16.38,18.05 16.76,17.67 16.76,16.68 16.55,16.47 | U5.P$5 46.74,42.74 47.24,43.25 47.24,46.35 46.35,47.24 C18.1 | U5.P$5 45.89,39.75 51.1,34.54 v57.28,34.54 | v60.2,34.54 R11.1 | U5.P$5 45.83,42.67 v44.32,42.67 | v31.88,53.59 32.13,53.34 U3.8 | 23.95,15.62 18.64,15.62 18.03,15.02 v18.03,14.99 16.55,16.47 | 6.22,15.24 J3.2 | v6.22,35.56 6.22,15.24 | 6.22,15.24 6.22,14.61 J2.3 | 16.55,16.47 15.41,16.47
  Bottom 0.203: v20.19,47.24 v20.19,45.85
  Bottom 0.305: v57.28,34.54 v60.2,34.54 | v44.32,42.67 42.8,42.67 | 42.8,42.67 v31.88,53.59 31.88,47.12 30.61,45.85 v20.19,45.85 | 42.8,42.67 35.69,35.56 31.75,35.56 | 31.75,35.56 v17.91,35.56 v12.95,35.56 v6.22,35.56 J4.1 | 31.75,35.56 31.75,30.48 J1.2 | J2.3 17.78,14.73 v18.03,14.99
+5V  (via drill 0.5)
  Top 0.305: R14.2 C16.2 C17.2 59.67,46.86 L4.P$2 58.28,43.04 56.77,41.53 v53.72,41.53 52.47,41.53 51.26,42.74 51.18,42.74 | 51.18,42.74 U5.P$1 | 51.18,42.74 51.18,43.69 50.23,44.64 U5.P$3 48.64,44.69 48.64,46.35 48.59,46.35 46.69,48.26 D4.+ | K1.2 58.95,10.79 D6.+ v47.5,21.72 | v39.12,37.21 v22.35,37.21 | v8.13,37.21 v8.13,14.99
  Bottom 0.305: v53.72,41.53 53.72,38.99 51.94,37.21 | 51.94,37.21 51.94,26.16 v47.5,21.72 | 51.94,37.21 v39.12,37.21 | v22.35,37.21 v8.13,37.21 6.48,37.21 J4.3 | v8.13,14.99 5.84,12.7 J3.1
A0  (via drill 0.35)
  Top 0.203: U1.23 25.78,19.65 26.42,20.29 v26.42,21.21
  Bottom 0.203: v26.42,21.21 25.15,21.21 24.38,21.97 13.97,21.97 9.78,17.78 J3.3
A1  (via drill 0.35)
  Top 0.203: U1.24 25.15,20.45 25.53,20.83 v25.53,22.48
  Bottom 0.203: v25.53,22.48 13.84,22.48 11.68,20.32 J3.4
A2  (via drill 0.35)
  Top 0.203: U1.25 22.48,22.99 22.74,23.24 23.75,23.24 v24.26,23.75
  Bottom 0.203: v24.26,23.75 3.94,23.75 J3.5
A3  (via drill 0.35)
  Top 0.203: U1.26 21.69,21.95 21.69,23.6 22.23,24.13 23.62,24.13 24.38,24.89 v24.38,25.02
  Bottom 0.203: v24.38,25.02 24,25.4 J3.6
A6  (via drill 0.35)
  Top 0.203: U1.19 v22.48,16.45 v22.48,16.46 | v5.33,16.76 4.7,17.4 4.7,27.18 3.94,27.94 J3.7
  Bottom 0.203: v22.48,16.46 17.48,21.46 14.09,21.46 9.42,16.79 5.36,16.79 v5.33,16.76
AUDIO-L  (via drill 0.35)
  Top 0.152: 21.88,54.3 C8.1 | U2.14
  Top 0.203: U2.14 19.81,48.64 v20.07,48.9 | v20.57,53.21 21.66,54.3 21.88,54.3
  Bottom 0.203: v20.07,48.9 20.07,50.93 20.57,51.44 v20.57,53.21
AUDIO-R  (via drill 0.35)
  Top 0.152: v20.7,48.13 v20.7,48.14 | 22.23,52.07 C7.1
  Top 0.203: v20.7,48.14 U2.13 | v21.34,51.18 22.23,52.07
  Bottom 0.203: v20.7,48.13 20.7,50.55 v21.34,51.18
BTN  (via drill 0.35)
  Top 0.203: v55.88,33.02 55.88,32.64 33.53,10.29 22.35,10.29 20.89,11.75 U1.14 | v58.55,33.02 R11.2 X4.1
  Bottom 0.203: v55.88,33.02 v58.55,33.02
CTS  (via drill 0.35)
  Top 0.203: U1.2 16.64,19.65 17.2,19.1 v17.2,18.59
  Bottom 0.203: v17.2,18.59 17.2,5 J2.2
GND  (via drill 0.35, 0.5)
  Top 0.152: 15.37,17.27 U1.5
  Top 0.203: C2.2 15.37,17.27 | U2.21 17.78,48.41 18.51,49.14 U2.15 19.05,49.21 U2.16 | Y1.2 v14.48,13.84 | U2.12 18.53,47.64 U2.21 | U2.4 17.33,48.14 17.33,48.13 17.53,48.13 U2.21 | v14.1,19.94 14.12,19.94 14.12,19.5 14.77,18.85 U1.3
  Top 0.305: U5.P$2 50.03,43.69 v50.03,43.68
  other vias: 17.78,39.5 15.57,26.54 21.84,19.81 6.1,45.97 43.18,57.91 43.56,29.97 43.81,14.22 68.33,10.67 63.25,29.72 68.83,48.64
  pour Bottom (isolate 0.254): 0,60.96 0,0 78.74,0 78.74,60.96
  pour Top (isolate 0.254): 0,0 78.74,0 78.74,60.96 0,60.96
INT-SI  (via drill 0.35)
  Top 0.203: v18.54,51.05 18.03,50.54 U2.18 | v15.75,38.99 15.75,38.73 16.51,37.97 16.51,23.46 16.89,23.09 U1.32
  Bottom 0.203: v18.54,51.05 15.75,48.26 v15.75,38.99
L  (via drill 0.35)
  Top 0.152: L2.2 v27.18,48.39
  Bottom 0.152: v27.18,48.39 27.18,56.13 28.19,57.15 X2.1
LED-1
  Top 0.203: U1.10 17.68,11.81 20.73,8.76 29.46,8.76 R9.1
LED-2
  Top 0.203: U1.11 18.48,11.81 21.15,9.14 35.43,9.14 R10.1
LED-3
  Top 0.203: U1.12 19.29,11.83 21.59,9.53 34.04,9.53 62.61,38.1 R12.1
LED-4
  Top 0.203: R13.1 67.06,43.18 33.78,9.91 21.97,9.91 20.09,11.79 U1.13
MISO
  Top 0.203: U1.16 22.48,12.22 22.74,11.96 27.46,11.96 34.8,19.3 34.8,29.34 33.66,30.48 29.08,30.48 27.94,29.34 J1.1
MOSI
  Top 0.203: J1.4 35.18,29.59 35.18,19.18 27.56,11.56 22.35,11.56 21.68,12.22 U1.15
N$1
  Top 0.203: U1.7 14.64,15.65 14.03,15.04 Y1.1
N$2
  Top 0.203: U1.8 15.37,14.85 15.37,13.53 14.48,12.64 Y1.3
N$3
  Top 0.203: U1.20 24,17.27 C1.2
N$4
  Top 0.203: C5.2 21.98,49.66 Y2.2 21.97,49.78 21.34,50.42 18.78,50.42 18.53,50.16 U2.17
N$5
  Top 0.203: C6.2 23.86,48.15 Y2.1 21.97,47.75 20.7,46.48 20.69,46.49 18.36,46.49 18.14,46.72 18.14,46.95 U2.9
N$6
  Top 0.203: C13.1 15.24,49.91 L1.1 15.85,49.14 U2.2
N$7
  Top 0.203: R5.1 26.16,52.07 C7.2
N$8
  Top 0.203: R6.1 24.89,54.23 C8.2
N$9
  Top 0.203: U3.3 34.67,45.46 35.18,44.95 C11.1
N$10
  Top 0.203: R7.1 33.4,44.7 U3.2 33.4,48.01 32.51,48.9 28.7,48.9 27.81,49.78 R5.2
N$11
  Top 0.203: U3.1 32.13,44.7 R7.2 32,42.29 33.02,41.27 38.73,41.27 40.01,42.55 40.01,48.39 C10.A
N$12
  Top 0.203: U3.6 34.67,53.59 R8.1 34.8,54.23 34.16,54.86 R6.2
N$13  (via drill 0.35)
  Top 0.203: R8.2 33.4,53.59 U3.7 33.4,50.67 33.02,50.29 29.84,50.29 v29.21,49.66 | C9.A 29.46,47.24 v28.57,48.13
  Bottom 0.203: v28.57,48.13 28.57,49.02 v29.21,49.66
N$14
  Top 0.152: C9.C 26.16,45.26 L2.1
N$17
  Top 0.203: L3.1 39.37,52.2 C10.C
N$18
  Top 0.203: R12.2 X4.3
N$19
  Top 0.203: R10.2 D3.+
N$20
  Top 0.203: R9.2 D2.+
N$21
  Top 0.203: R13.2 X4.5
N$22
  Top 0.203: X1.1 16.51,54.48 | 16.51,54.48 16.83,54.16 D1.1 | C13.2 16.51,54.48
N$24  (via drill 0.5)
  Top 0.305: U4.1 54.99,51.37 v54.99,50.04 | v51.44,51.05 D4.- C15.2
  Bottom 0.305: v51.44,51.05 52.45,50.04 v54.99,50.04
N$26
  Bottom 2.54: K1.1 58.55,16.76 63.12,21.34 70.95,21.34 X3.2
N$27
  Top 0.305: U4.3 R15.1 R14.1
N$28
  Bottom 2.54: K1.4 66.84,15.37 71.84,15.37 X3.1
N$29
  Bottom 2.54: K1.5 60.27,25.38 X3.3
N$30
  Top 0.203: D6.- Q1.3 K1.3
N$31
  Top 0.203: R16.2 Q1.1
R
  Top 0.203: L3.2 39.33,57.15 X2.3
RELAY  (via drill 0.35)
  Top 0.203: v42.93,8.38 R16.1 | v25.78,18.54 25.47,18.85 U1.22
  Bottom 0.203: v25.78,18.54 32.77,18.54 v42.93,8.38
RST-AVR  (via drill 0.35)
  Top 0.203: v19.05,27.18 R1.1 19.05,23.62 19.3,23.37 19.3,21.96 U1.29
  Bottom 0.203: v19.05,27.18 22.35,30.48 29.21,30.48 J1.5
RST-SI
  Top 0.203: U2.5 16.43,47.62 R4.2 14.61,24.38 11.05,20.83 11.05,11.81 11.56,11.3 14.22,11.3 16.26,13.34 16.86,13.34 U1.9
RTS  (via drill 0.35)
  Top 0.203: U1.1 v16.76,20.45
  Bottom 0.203: J2.6 25.4,11.81 v16.76,20.45
RXD  (via drill 0.35)
  Top 0.203: U1.31 17.68,20.3 17.83,20.15 v17.83,17.07 | v19.68,5.21 20.7,5.21 J2.5
  Bottom 0.203: v17.83,17.07 17.83,16.97 19.68,15.11 v19.68,5.21
SCK
  Top 0.203: J1.3 33.02,19.81 28.06,14.85 U1.17
SCL
  Top 0.203: U1.28 20.09,29.34 19.43,29.99 R3.2 19.43,40.13 17.03,42.53 U2.7
SDA
  Top 0.203: U1.27 20.89,23.43 21.08,23.62 R2.2 21.08,39.25 17.53,42.8 U2.8
SW
  Top 0.254: D5.2
  Top 0.305: D5.2 52.96,53.73 | 52.96,53.73 U4.6 | 52.96,53.73 52.96,45.48 L4.P$1 51.82,45.47 C15.1
TXD  (via drill 0.35)
  Top 0.152: v18.48,17.73 v18.49,17.73
  Top 0.203: U1.30 v18.48,17.73
  Bottom 0.203: v18.49,17.73 20.32,15.9 J2.4
VIN
  Top 0.305: C14.2 55.24,57.02 55.88,56.39 | 55.88,56.39 U4.5 U4.4 | 55.88,56.39 56.77,57.28 X5.1

### Text on the board
tNames: Manuel Rabade (2019)